# Altium schematic sheet USB Hub.SchDoc
size A4
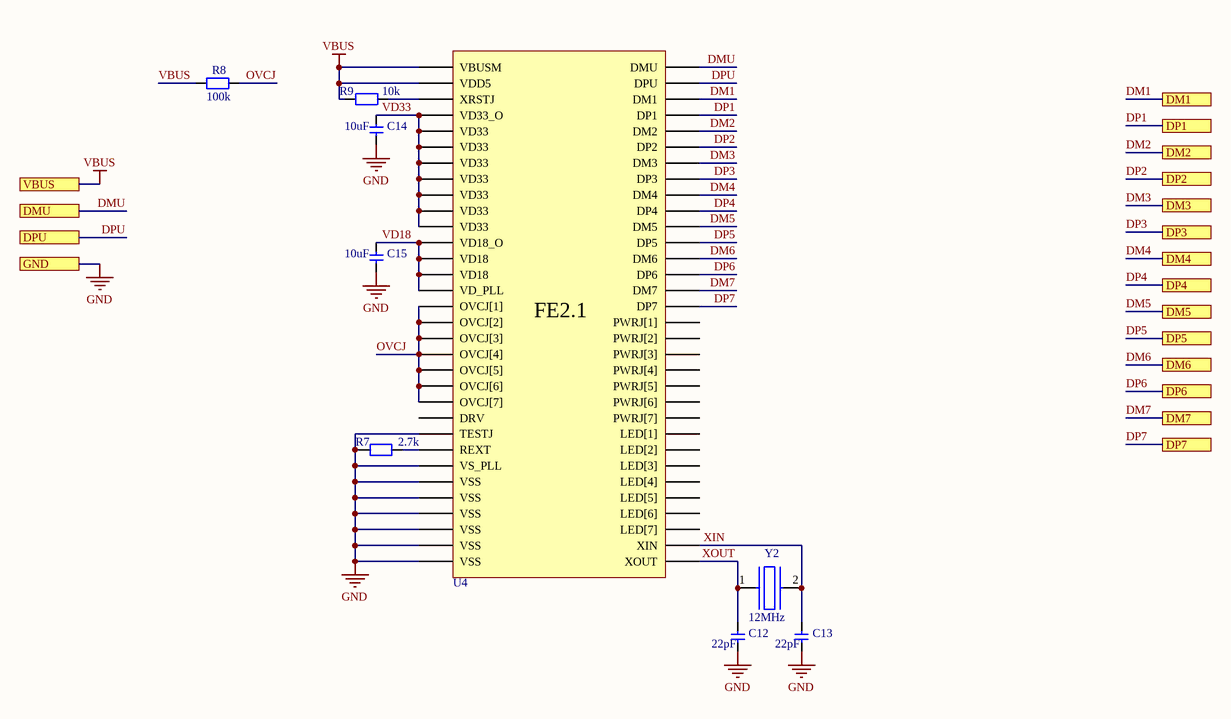
[diagram p0: USB Hub.SchDoc]

## Parts
C12  22pF  [cap0603]
C13  22pF  [cap0603]
C14  10uF  [cap0603]
C15  10uF  [cap0603]
R7  2.7k  [res0603]
R8  100k  [res0603]
R9  10k  [res0603]
U4  FE2.1  [LQFP64_N_1]  (value not drawn)
Y2  12MHz

## Ports
DM1, DM2, DM3, DM4, DM5, DM6, DM7, DMU, DP1, DP2, DP3, DP4, DP5, DP6, DP7, DPU, GND, VBUS

## Nets
GND: C12.1 C13.1 C14.1 C15.1 R7.1 U4.3(TESTJ) U4.11(VSS) U4.19(VSS) U4.25(VSS) U4.32(VS_PLL) U4.37(VSS) U4.43(VSS) U4.49(VSS) ; port GND
VBUS: R8.1 R9.1 U4.9(VDD5) U4.51(VBUSM) ; port VBUS
DM1: U4.26(DM1) ; port DM1
DM2: U4.23(DM2) ; port DM2
DM3: U4.20(DM3) ; port DM3
DM4: U4.17(DM4) ; port DM4
DM5: U4.41(DM5) ; port DM5
DM6: U4.44(DM6) ; port DM6
DM7: U4.47(DM7) ; port DM7
DMU: U4.38(DMU) ; port DMU
DP1: U4.27(DP1) ; port DP1
DP2: U4.24(DP2) ; port DP2
DP3: U4.21(DP3) ; port DP3
DP4: U4.18(DP4) ; port DP4
DP5: U4.42(DP5) ; port DP5
DP6: U4.45(DP6) ; port DP6
DP7: U4.48(DP7) ; port DP7
DPU: U4.39(DPU) ; port DPU
OVCJ: R8.2 U4.14(PWRJ[4]) U4.15(OVCJ[2]) U4.16(OVCJ[3]) U4.17(OVCJ[4]) U4.18(OVCJ[5]) U4.19(OVCJ[6]) U4.20(OVCJ[7])
VD18: C15.2 U4.7(VD18) U4.29(VD_PLL) U4.33(VD18_O) U4.36(VD18)
VD33: C14.2 U4.10(VD33_O) U4.16(VD33) U4.22(VD33) U4.28(VD33) U4.34(VD33) U4.40(VD33) U4.46(VD33) U4.56(VD33)
XIN: C13.2 U4.30(XIN) Y2.2
XOUT: C12.2 U4.31(XOUT) Y2.1
NetR7_2: R7.2 U4.35(REXT)
NetR9_2: R9.2 U4.50(XRSTJ)

Not connected (* = marked no-connect by the designer): U4 1(LED[5]) 2(DRV) 4(LED[1]) 5(LED[2]) 6(LED[3]) 8(LED[4]) 12(PWRJ[3]) 52(PWRJ[7]) 54(PWRJ[6]) 57(PWRJ[5]) 59(PWRJ[1]) 61(PWRJ[2]) 63(LED[7]) 64(LED[6])

## Library data of the parts
C12-C15 = Cap SMD
R7-R9 = Resistor SMD
Y2 = Quartz